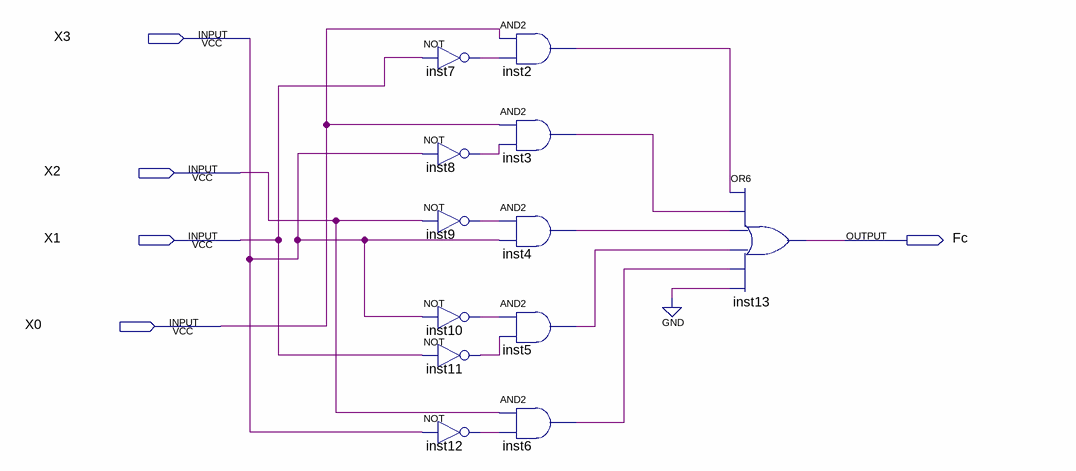
[diagram p0: schematic sheet]
// Quartus schematic Segmento3.bdf as structural Verilog: 12 symbols, 5 pins
module Segmento3 (
  input  X3,
  input  X2,
  input  X1,
  input  X0,
  output Fc
);

  wire inst2_out, inst3_out, inst4_out, inst5_out, inst6_out, inst7_out, inst8_out, inst9_out, inst10_out,
       inst11_out, inst12_out;

  not inst7 (inst7_out, X1);
  not inst8 (inst8_out, X3);
  not inst9 (inst9_out, X2);
  not inst10 (inst10_out, X3);
  not inst11 (inst11_out, X1);
  not inst12 (inst12_out, X3);
  and inst2 (inst2_out, X0, inst7_out);
  and inst3 (inst3_out, X0, inst8_out);
  and inst4 (inst4_out, inst9_out, X3);
  and inst5 (inst5_out, inst10_out, inst11_out);
  and inst6 (inst6_out, X2, inst12_out);
  or inst13 (Fc, inst2_out, inst3_out, inst4_out, inst5_out, inst6_out, 1'b0);
endmodule
